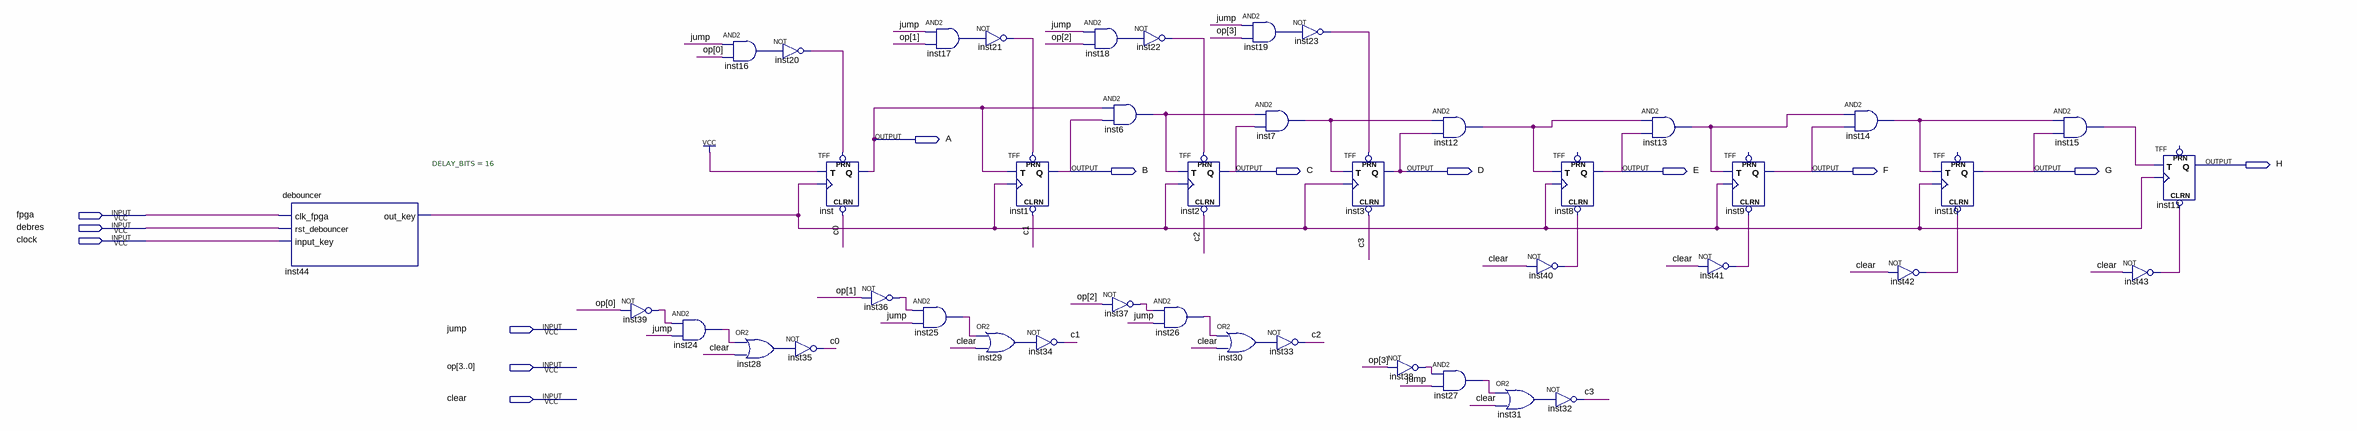
[diagram p0: schematic sheet]
// Quartus schematic contador.bdf as structural Verilog: 43 symbols, 14 pins
module contador (
  input  fpga,
  input  debres,
  input  clock,
  input  jump,
  input  [3:0] op,
  input  clear,
  output A,
  output H,
  output B,
  output C,
  output D,
  output E,
  output F,
  output G
);

  wire c0, c1, c2, c3, inst6_out, inst7_out, inst12_out, inst13_out, inst14_out, inst15_out, inst16_out,
       inst17_out, inst18_out, inst19_out, inst20_out, inst21_out, inst22_out, inst23_out, inst24_out,
       inst25_out, inst26_out, inst27_out, inst28_out, inst29_out, inst30_out, inst31_out, inst36_out,
       inst37_out, inst38_out, inst39_out, inst40_out, inst41_out, inst42_out, inst43_out, inst44_out_key;

  debouncer #(.DELAY_BITS(16)) inst44 (
    .clk_fpga(fpga), .rst_debouncer(debres), .input_key(clock), .out_key(inst44_out_key));
  not inst39 (inst39_out, op[0]);
  and inst24 (inst24_out, inst39_out, jump);
  and inst16 (inst16_out, jump, op[0]);
  not inst20 (inst20_out, inst16_out);
  or inst28 (inst28_out, inst24_out, clear);
  TFF inst (.PRN(inst20_out), .CLRN(c0), .T(1'b1), .CLK(inst44_out_key), .Q(A));
  not inst35 (c0, inst28_out);
  not inst36 (inst36_out, op[1]);
  and inst17 (inst17_out, jump, op[1]);
  and inst25 (inst25_out, inst36_out, jump);
  not inst21 (inst21_out, inst17_out);
  or inst29 (inst29_out, inst25_out, clear);
  TFF inst1 (.PRN(inst21_out), .CLRN(c1), .T(A), .CLK(inst44_out_key), .Q(B));
  not inst34 (c1, inst29_out);
  and inst18 (inst18_out, jump, op[2]);
  and inst6 (inst6_out, A, B);
  not inst37 (inst37_out, op[2]);
  not inst22 (inst22_out, inst18_out);
  TFF inst2 (.PRN(inst22_out), .CLRN(c2), .T(inst6_out), .CLK(inst44_out_key), .Q(C));
  and inst26 (inst26_out, inst37_out, jump);
  or inst30 (inst30_out, inst26_out, clear);
  and inst19 (inst19_out, jump, op[3]);
  and inst7 (inst7_out, inst6_out, C);
  not inst33 (c2, inst30_out);
  not inst23 (inst23_out, inst19_out);
  TFF inst3 (.PRN(inst23_out), .CLRN(c3), .T(inst7_out), .CLK(inst44_out_key), .Q(D));
  and inst12 (inst12_out, inst7_out, D);
  not inst38 (inst38_out, op[3]);
  and inst27 (inst27_out, inst38_out, jump);
  not inst40 (inst40_out, clear);
  or inst31 (inst31_out, inst27_out, clear);
  TFF inst8 (.CLRN(inst40_out), .T(inst12_out), .CLK(inst44_out_key), .Q(E));  // open: PRN
  not inst32 (c3, inst31_out);
  and inst13 (inst13_out, inst12_out, E);
  TFF inst9 (.CLRN(inst41_out), .T(inst13_out), .CLK(inst44_out_key), .Q(F));  // open: PRN
  not inst41 (inst41_out, clear);
  and inst14 (inst14_out, inst13_out, F);
  not inst42 (inst42_out, clear);
  TFF inst10 (.CLRN(inst42_out), .T(inst14_out), .CLK(inst44_out_key), .Q(G));  // open: PRN
  and inst15 (inst15_out, inst14_out, G);
  not inst43 (inst43_out, clear);
  TFF inst11 (.CLRN(inst43_out), .T(inst15_out), .CLK(inst44_out_key), .Q(H));  // open: PRN
endmodule
